# Altium schematic sheet ADCIN_ACcoupled_BAL-0006SMG.SchDoc
size A3
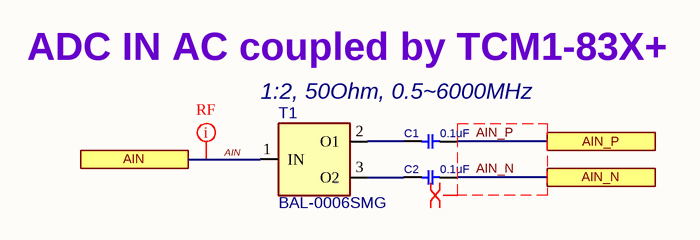
[diagram p0: ADCIN_ACcoupled_BAL-0006SMG.SchDoc]

## Parts
C1  0.1uF  [C0402]
C2  0.1uF  [C0402]
T1  BAL-0006SMG  [BAL-0006SMG]

## Ports
AIN, AIN_N, AIN_P

## Nets
AIN: T1.1(IN) ; port AIN
AIN_N: C2.2 ; port AIN_N
AIN_P: C1.2 ; port AIN_P
NetC1_1: C1.1 T1.2(O1)
NetC2_1: C2.1 T1.3(O2)

## Layout directives
net class RF: AIN
differential pair: AIN_N, AIN_P

## Notes on the sheet
- ADC IN AC coupled by TCM1-83X+
- 1:2, 50Ohm, 0.5~6000MHz
- Title
- Size:
- Date:
- A3
- Number:
- Time:
- Revision:
- Sheet
- of
- File:

## Library data of the parts
C1 C2 = CAP_SMD_MLCC_100n50T: CAP, MLCC, 100nF, 50V, X7R, 10%, 0402C; MANF_P#: UMK105B7104KVHF; MANF: Taiyo Yuden; PARAM: 50V; DESC: CAP, MLCC, 100nF, 50V, X7R, 10%, 0402C; PARAM2: X7R, 10%; ASSEMBLY: ASSEMBLY; PRICE: 100= 5$; VALUE: 0.1uF
T1 = BAL-0006SMG: RF Transformer, 1:2, 50Ohm, 0.5~6000MHz; MANF: MARKI microwave; DESC: DESCRIPTION; PARAM2: 1W; ASSEMBLY: ASSEMBLY; PARAM: 1:2, 50Ohm, 0.5~6000MHz; PRICE: PRICE; MANF_P#: BAL-0006SMG; VALUE: BAL-0006SMG